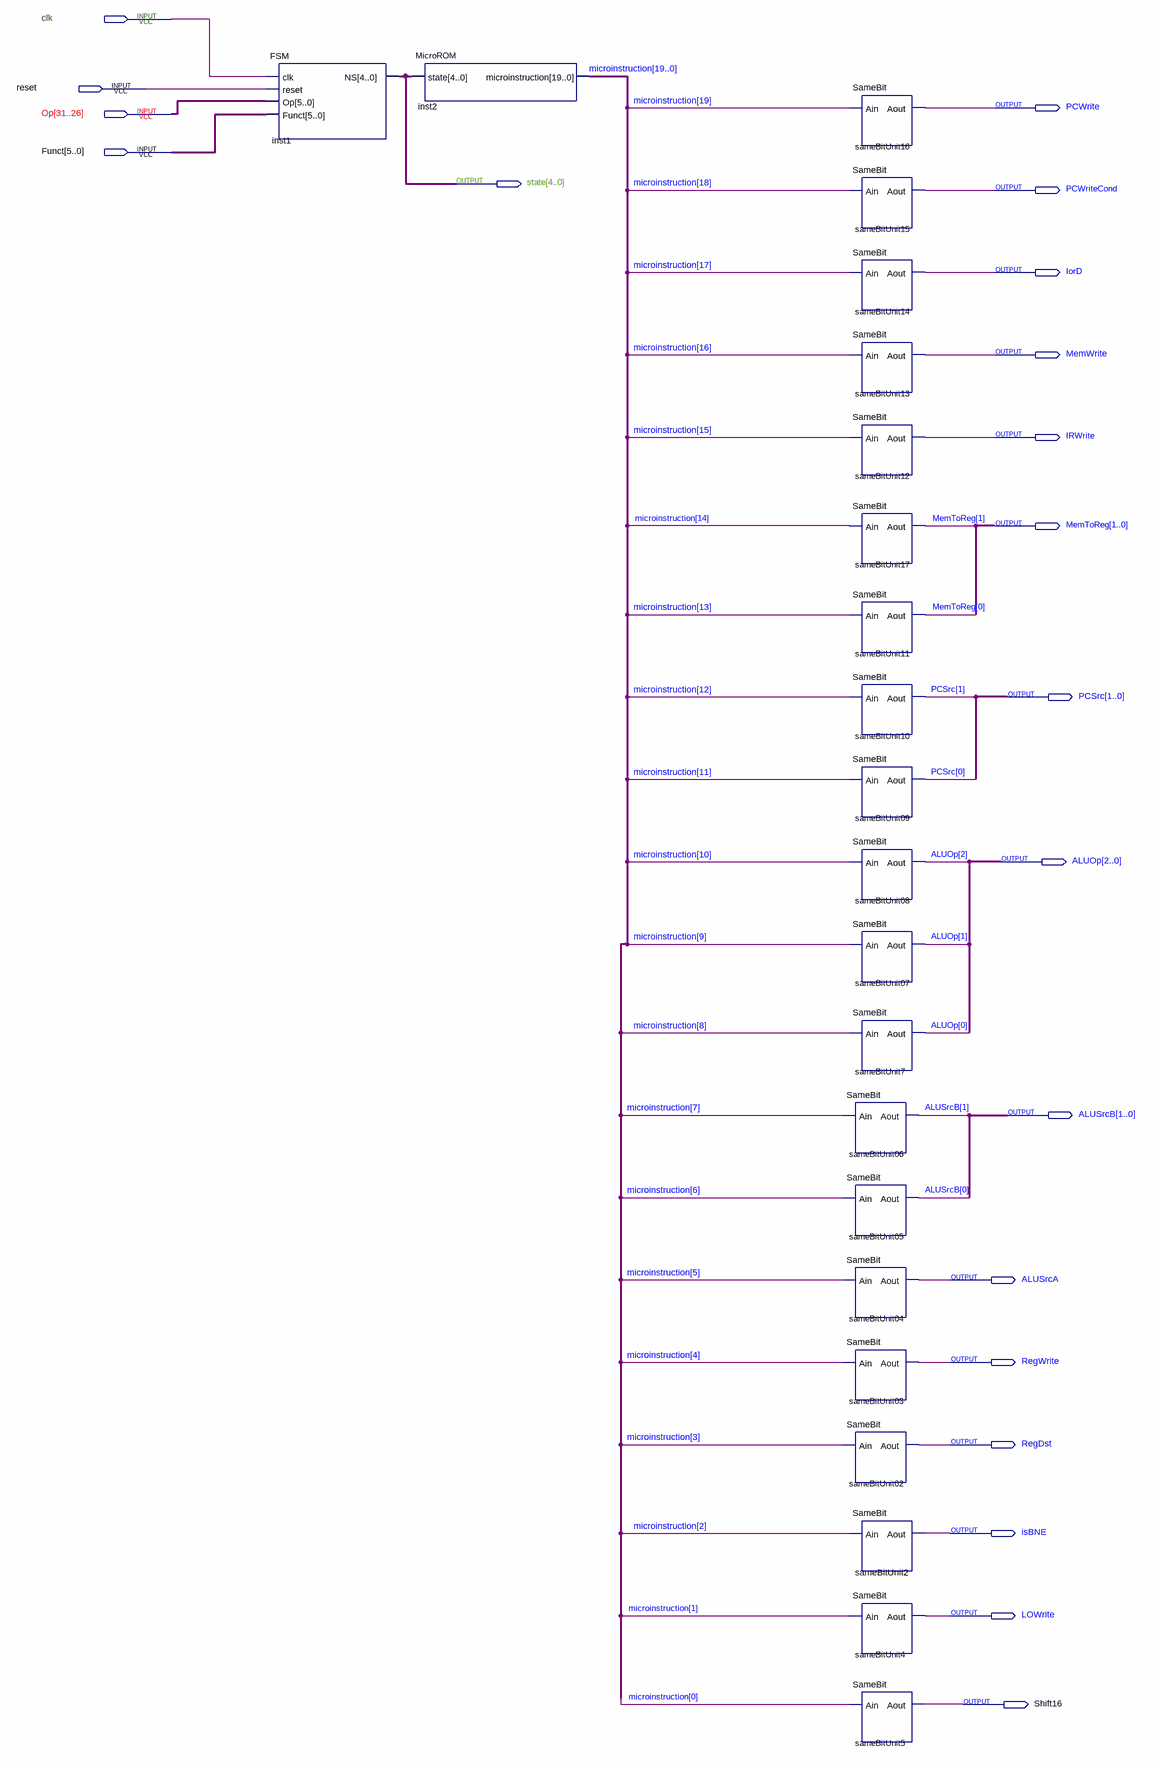
[diagram p0: schematic sheet]
// Quartus schematic CTRL.bdf as structural Verilog: 22 symbols, 20 pins
module CTRL (
  input  clk,
  input  reset,
  input  [31:26] Op,
  input  [5:0] Funct,
  output PCWrite,
  output [4:0] state,
  output PCWriteCond,
  output IorD,
  output MemWrite,
  output IRWrite,
  output [1:0] MemToReg,
  output [1:0] PCSrc,
  output [2:0] ALUOp,
  output [1:0] ALUSrcB,
  output ALUSrcA,
  output RegWrite,
  output RegDst,
  output isBNE,
  output LOWrite,
  output Shift16
);

  wire [19:0] microinstruction;

  FSM inst1 (.clk(clk), .reset(reset), .Op(Op), .Funct(Funct), .NS(state));
  MicroROM inst2 (.state(state), .microinstruction(microinstruction));
  SameBit sameBitUnit16 (.Ain(microinstruction[19]), .Aout(PCWrite));
  SameBit sameBitUnit15 (.Ain(microinstruction[18]), .Aout(PCWriteCond));
  SameBit sameBitUnit14 (.Ain(microinstruction[17]), .Aout(IorD));
  SameBit sameBitUnit13 (.Ain(microinstruction[16]), .Aout(MemWrite));
  SameBit sameBitUnit12 (.Ain(microinstruction[15]), .Aout(IRWrite));
  SameBit sameBitUnit17 (.Ain(microinstruction[14]), .Aout(MemToReg[1]));
  SameBit sameBitUnit11 (.Ain(microinstruction[13]), .Aout(MemToReg[0]));
  SameBit sameBitUnit10 (.Ain(microinstruction[12]), .Aout(PCSrc[1]));
  SameBit sameBitUnit09 (.Ain(microinstruction[11]), .Aout(PCSrc[0]));
  SameBit sameBitUnit08 (.Ain(microinstruction[10]), .Aout(ALUOp[2]));
  SameBit sameBitUnit07 (.Ain(microinstruction[9]), .Aout(ALUOp[1]));
  SameBit sameBitUnit7 (.Ain(microinstruction[8]), .Aout(ALUOp[0]));
  SameBit sameBitUnit06 (.Ain(microinstruction[7]), .Aout(ALUSrcB[1]));
  SameBit sameBitUnit05 (.Ain(microinstruction[6]), .Aout(ALUSrcB[0]));
  SameBit sameBitUnit04 (.Ain(microinstruction[5]), .Aout(ALUSrcA));
  SameBit sameBitUnit03 (.Ain(microinstruction[4]), .Aout(RegWrite));
  SameBit sameBitUnit02 (.Ain(microinstruction[3]), .Aout(RegDst));
  SameBit sameBitUnit2 (.Ain(microinstruction[2]), .Aout(isBNE));
  SameBit sameBitUnit4 (.Ain(microinstruction[1]), .Aout(LOWrite));
  SameBit sameBitUnit5 (.Ain(microinstruction[0]), .Aout(Shift16));
endmodule
